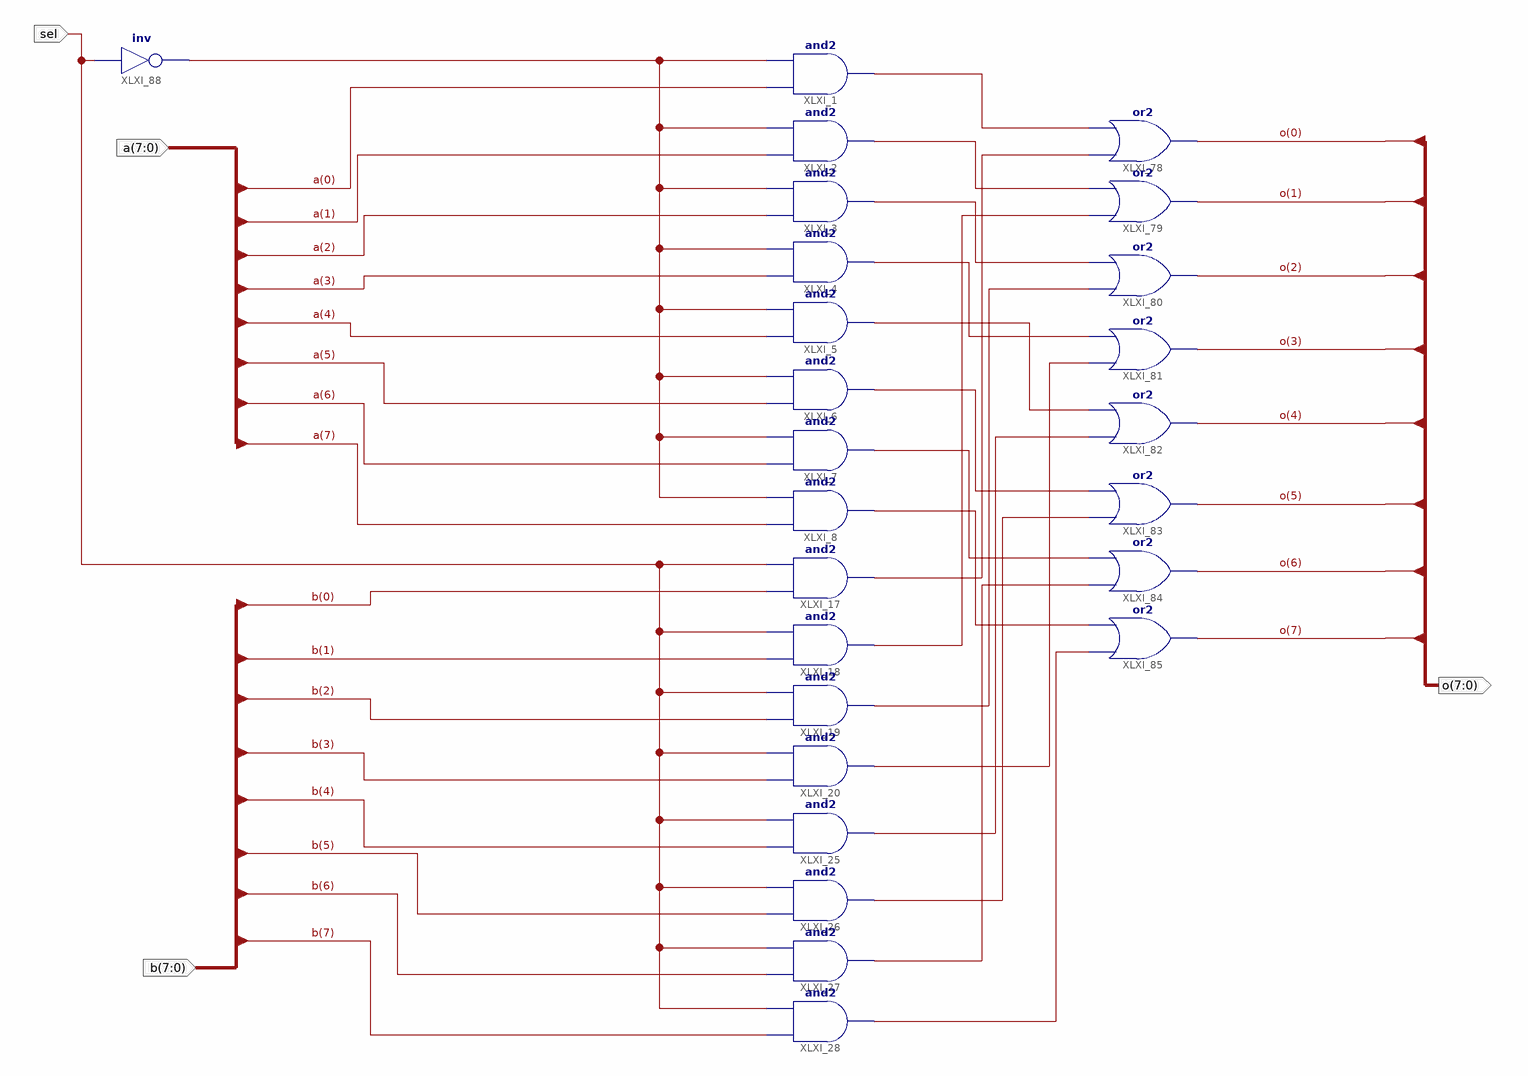
[diagram p0: schematic sheet 1]
// Xilinx ISE schematic MUXHM.sch (kintex7) as structural Verilog: 25 symbols, 4 ports
module MUXHM (
  input  [7:0] a,
  input  [7:0] b,
  input  sel,
  output [7:0] o
);

  wire nsel, XLXN_60, XLXN_61, XLXN_62, XLXN_63, XLXN_64, XLXN_65, XLXN_67, XLXN_68, XLXN_69, XLXN_70,
       XLXN_71, XLXN_72, XLXN_73, XLXN_74, XLXN_75, XLXN_76;

  and XLXI_1 (XLXN_60, a[0], nsel);
  and XLXI_2 (XLXN_62, a[1], nsel);
  and XLXI_3 (XLXN_63, a[2], nsel);
  and XLXI_4 (XLXN_64, a[3], nsel);
  and XLXI_5 (XLXN_65, a[4], nsel);
  and XLXI_6 (XLXN_67, a[5], nsel);
  and XLXI_7 (XLXN_68, a[6], nsel);
  and XLXI_8 (XLXN_69, a[7], nsel);
  and XLXI_17 (XLXN_61, b[0], sel);
  and XLXI_18 (XLXN_70, b[1], sel);
  and XLXI_19 (XLXN_71, b[2], sel);
  and XLXI_20 (XLXN_72, b[3], sel);
  and XLXI_25 (XLXN_73, b[4], sel);
  and XLXI_26 (XLXN_74, b[5], sel);
  and XLXI_27 (XLXN_75, b[6], sel);
  and XLXI_28 (XLXN_76, b[7], sel);
  or XLXI_78 (o[0], XLXN_61, XLXN_60);
  or XLXI_79 (o[1], XLXN_70, XLXN_62);
  or XLXI_80 (o[2], XLXN_71, XLXN_63);
  or XLXI_81 (o[3], XLXN_72, XLXN_64);
  or XLXI_82 (o[4], XLXN_73, XLXN_65);
  or XLXI_83 (o[5], XLXN_74, XLXN_67);
  or XLXI_84 (o[6], XLXN_75, XLXN_68);
  or XLXI_85 (o[7], XLXN_76, XLXN_69);
  not XLXI_88 (nsel, sel);
endmodule
